# EAGLE schematic LCD_Disp_AIR_NTCand Connector (EAGLE 6.4)
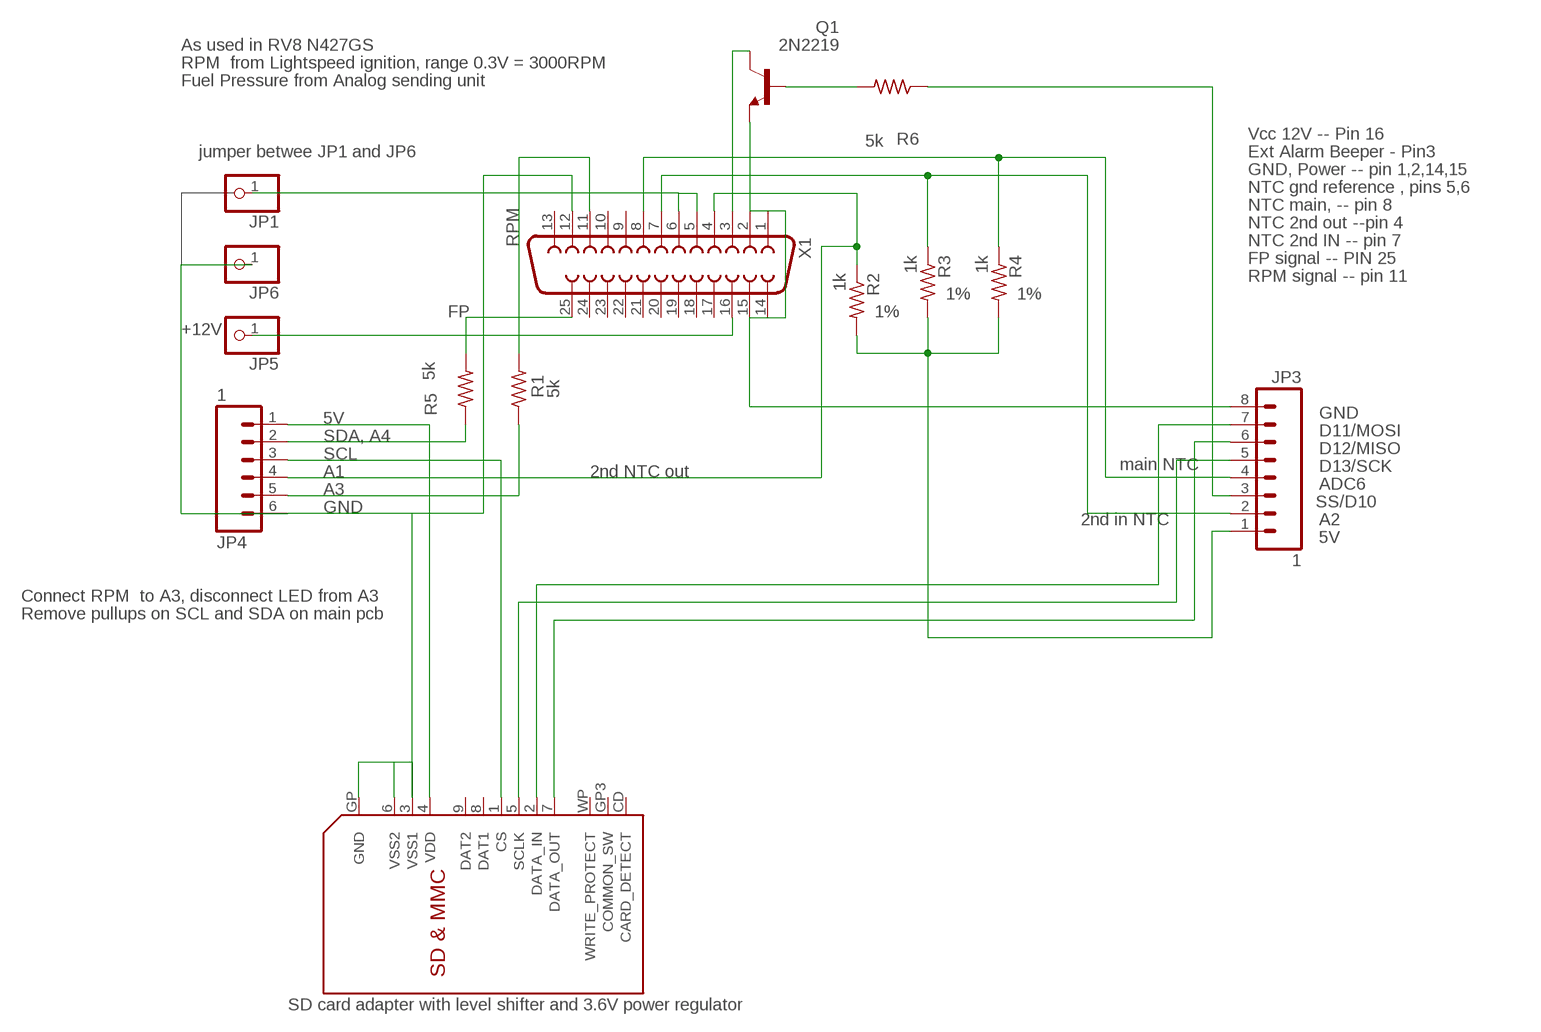
[diagram p0: schematic, sheet 1]

## Parts
JP1  PINHD-1X1CB  [1X01-CLEANBIG]
JP3  1  M081X08  [1X08]
JP4  1  M06SIP  [1X06]
JP5  PINHD-1X1  [1X01]
JP6  PINHD-1X1CB  [1X01-CLEANBIG]
Q1  2N2219  [TO5]
R1  5k  R-US_M0805  [M0805]
R2  1k  R-US_0204/7  [0204/7]
R3  1k  R-US_0204/7  [0204/7]
R4  1k  R-US_0204/7  [0204/7]
R5  5k  R-US_M0805  [M0805]
R6  5k  R-US_M0805  [M0805]
U$1  SDMMC06132  [06132]
X1  DB25_FEMALEVB  [F25VB]

## Nets
+12V: JP5.1 X1.16
GND: JP4.6 JP6.1 U$1.3(VSS1) U$1.6(VSS2) U$1.GP(GND) X1.12
MISO: JP3.6 U$1.7(DATA_OUT)
MOSI: JP3.7 U$1.2(DATA_IN)
N$1: R5.2 X1.25
N$2: JP1.1 X1.5 X1.6
N$3: JP3.1 R2.2 R3.2 R4.2
N$4: JP3.8 Q1.1(E) X1.1 X1.2 X1.14 X1.15
N$5: JP4.5 R1.1
N$6: JP4.2 R5.1
N$7: R1.2 X1.11
N$8: JP3.2 R3.1 X1.7
N$9: JP3.4 R4.1 X1.8
N$10: JP4.4 R2.1 X1.4
N$13: Q1.3(C)
N$14: Q1.2(B) R6.2
N$15: JP3.3 R6.1
SCI_SD_SS: JP4.3 U$1.1(CS)
SCLK: JP3.5 U$1.5(SCLK)
VDD: JP4.1 U$1.4(VDD)
Unconnected: U$1.8(DAT1) U$1.9(DAT2) U$1.CD(CARD_DETECT) U$1.GP3(COMMON_SW) U$1.WP(WRITE_PROTECT) X1.3 X1.9 X1.10 X1.13 X1.17 X1.18 X1.19 X1.20 X1.21 X1.22 X1.23 X1.24

## Notes on the sheet
- As used in RV8 N427GS
- RPM  from Lightspeed ignition, range 0.3V = 3000RPM
- Fuel Pressure from Analog sending unit
- Vcc 12V -- Pin 16
- jumper betwee JP1 and JP6 | Ext Alarm Beeper - Pin3
- GND, Power -- pin 1,2,14,15
- NTC gnd reference , pins 5,6
- NTC main, -- pin 8
- NTC 2nd out --pin 4
- RPM | NTC 2nd IN -- pin 7
- FP signal -- PIN 25
- RPM signal -- pin 11
- 1% | 1%
- FP | 1%
- GND
- 5V | D11/MOSI
- SDA, A4 | D12/MISO
- SCL | D13/SCK
- main NTC
- A1 | 2nd NTC out | ADC6
- A3
- SS/D10
- GND | A2
- 2nd in NTC
- 5V
- Connect RPM  to A3, disconnect LED from A3
- Remove pullups on SCL and SDA on main pcb
- SD card adapter with level shifter and 3.6V power regulator

## Library data of the parts
JP1 JP5 JP6 = adafruit:PINHD-1X1: Pin header 1x1 for 0.1" spacing With round pins
JP3 = SparkFun-Connectors:M08: Header 8 Standard 8-pin 0.1" header. Use with straight break away headers (SKU : PRT-00116), right angle break away headers (PRT-00553), swiss pins (PRT-00743), machine pins (PRT-00117), and female headers (PRT-00115).
JP4 = SparkFun-Connectors:M06: Header 6 Standard 6-pin 0.1" header. Use with straight break away headers (SKU : PRT-00116), right angle break away headers (PRT-00553), swiss pins (PRT-00743), machine pins (PRT-00117), and female headers (PRT-00115). Molex polarized connector foot print use with SKU : PRT-08094 with associated crimp pins and housings. NOTES ON THE VARIANTS LOCK and LOCK_LONGPADS... This footprint was designed to help hold the alignment of a through-hole component (i.e. 6-pin header) while soldering it into place. You may notice that each hole has been shifted either up or down by 0.005 of an inch from it's more standard position (which is a perfectly straight line). This slight alteration caused the pins (the squares in the middle) to touch the edges of the holes. Because they are alternating, it causes a "brace" to hold the component in place. 0.005 has proven to be the perfect amount of "off-center" position when using our standard breakaway headers. Although looks a little odd when you look at the bare footprint, once you have a header in there, the alteration is very hard to notice. Also, if you push a header all the way into place, it is covered up entirely on the bottom side. This idea of altering the position of holes to aid alignment will be further integrated into the Sparkfun Library for other footprints. It can help hold any component with 3 or more connection pins.
Q1 = transistor-npn:2N2219: NPN Transistor
R1 R5 R6 = rcl:R-US_: RESISTOR, American symbol
R2-R4 = resistor:R-US_: RESISTOR, American symbol
U$1 = adafruit:SDMMC: SD MMC Card holder 4UCON part #06132 - easy to solder
X1 = SparkFun-Retired:DB25_FEMALE: 25 Pin male connector. PCB edge mount for regular PCB thicknesses. This connector will connect directly to the back of a PC parallel port or through a normal DB25 extension cable (M/F). SKU: PRT-08287

## Net classes
1 vcc: width 0.254 mm